# Altium schematic sheet Interface.SchDoc
size A4; SheetNumber: 2; SheetTotal: 2
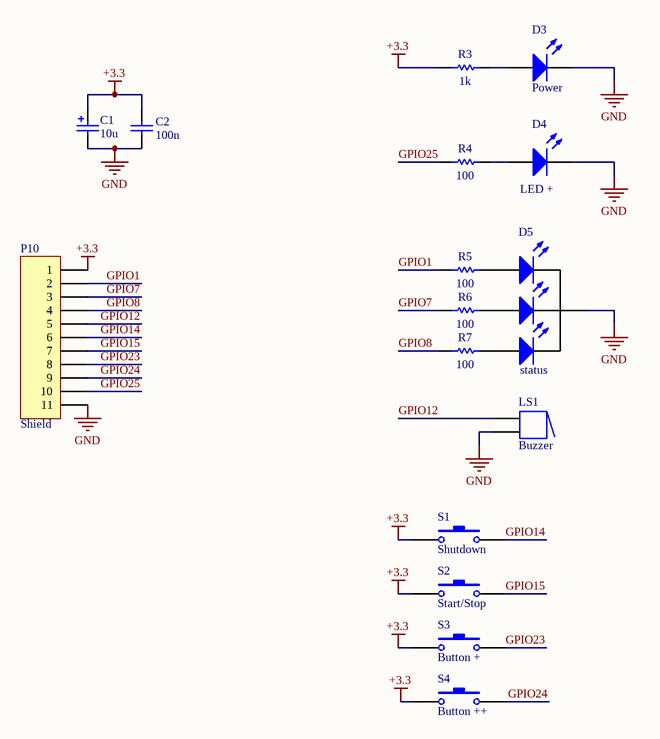
[diagram p0: Interface.SchDoc]

## Parts
C1  value 10u  [Rad5.2]  (hidden comment: Cap Pol1)
C2  value 100n  [RAD-0.2]  (hidden comment: Cap)
D3  Power  [LED_3MM]
D4  LED +  [LED_5mm]
D5  status  [LED RGB]
LS1  Buzzer  [Buzzer]
P10  Shield  [Conn_1X11]
R3  value 1k  [AXIAL-0.3]  (hidden comment: Res1)
R4  value 100  [AXIAL-0.3]  (hidden comment: Res1)
R5  value 100  [AXIAL-0.3]  (hidden comment: Res1)
R6  value 100  [AXIAL-0.3]  (hidden comment: Res1)
R7  value 100  [AXIAL-0.3]  (hidden comment: Res1)
S1  Shutdown  [SW_1825910-6-4]
S2  Start/Stop  [SW_1825910-6-4]
S3  Button +  [SW_1825910-6-4]
S4  Button ++  [SW_1825910-6-4]

## Nets
+3.3: C1.1 C2.1 P10.1 R3.1 S1.1 S2.1 S3.1 S4.1
GND: C1.2 C2.2 D3.2(K) D4.2(K) D5.2(K) LS1.2 P10.11
GPIO1: P10.2 R5.1
GPIO7: P10.3 R6.1
GPIO8: P10.4 R7.1
GPIO12: LS1.1 P10.5
GPIO14: P10.6 S1.2
GPIO15: P10.7 S2.2
GPIO23: P10.8 S3.2
GPIO24: P10.9 S4.2
GPIO25: P10.10 R4.1
NetD3_1: D3.1(A) R3.2
NetD4_1: D4.1(A) R4.2
NetD5_1: D5.1(R) R5.2
NetD5_3: D5.3(G) R6.2
NetD5_4: D5.4(B) R7.2

## Notes on the sheet
- Taile : A4
- Titre :
- Auteur :
- Sheet
- of
- Date :
- Prom. de l'Alma, 50
- ECAM
- 1200 Bruxelles
- Fichier :
- Rev. :

## Library data of the parts
C1 = Cap Pol1: Polarized Capacitor (Radial); Published: 8-Jun-2000; LatestRevisionDate: 17-Jul-2002; LatestRevisionNote: Re-released for DXP Platform.; PackageReference: RB7.6-15; Publisher: Altium Limited; PackageDescription: Polarized Capacitor (Radial); 2 Leads
C2 = Cap: Capacitor; Published: 8-Jun-2000; LatestRevisionDate: 17-Jul-2002; LatestRevisionNote: Re-released for DXP Platform.; PackageReference: RAD-0.3; Publisher: Altium Limited; PackageDescription: Radial Cap, Thru-Hole; 2 Leads; 0.3 in Pin Spacing
D3 D4 = LED0: Typical INFRARED GaAs LED; Published: 8-Jun-2000; LatestRevisionDate: 08-Jul-2005; LatestRevisionNote: Mech Layer 1 removed.; PackageReference: LED-0; Publisher: Altium Limited; PackageDescription: LED; 2 Leads
D5 = LED_RGB: Typical INFRARED GaAs LED; Published: 8-Jun-2000; LatestRevisionDate: 08-Jul-2005; LatestRevisionNote: Mech Layer 1 removed.; PackageReference: LED-0; Publisher: Altium Limited; PackageDescription: LED; 2 Leads
LS1 = Buzzer: Magnetic Transducer Buzzer; Published: 24-Mar-1999; LatestRevisionDate: 17-Dec-2003; LatestRevisionNote: Schematic revised, PCB Footprint replaced.; DatasheetVersion: 17-Dec-2003; PackageReference: ABSM-1574; Publisher: Altium Limited; PackageDescription: Magnetic Transducer Buzzer; ComponentLink1Description: Manufacturer Link; ComponentLink1URL: http://www.megastar.com/linecard/buzzmode/index.php
P10 = Header 11: Header, 11-Pin; LatestRevisionDate: 17-Jul-2002; LatestRevisionNote: Re-released for DXP Platform.; Publisher: Altium Limited
R3-R7 = Res1: Resistor; Published: 8-Jun-2000; LatestRevisionDate: 17-Jul-2002; LatestRevisionNote: Re-released for DXP Platform.; PackageReference: AXIAL-0.3; Publisher: Altium Limited; PackageDescription: Axial Device, Thru-Hole; 2 Leads; 0.3 in Pin Spacing
S1-S4 = SW-PB: Switch; Published: 24-Mar-1999; LatestRevisionDate: 17-Jul-2002; LatestRevisionNote: Re-released for DXP Platform.; PackageReference: SPST-2; Publisher: Altium Limited; PackageDescription: Switch; 2 Leads